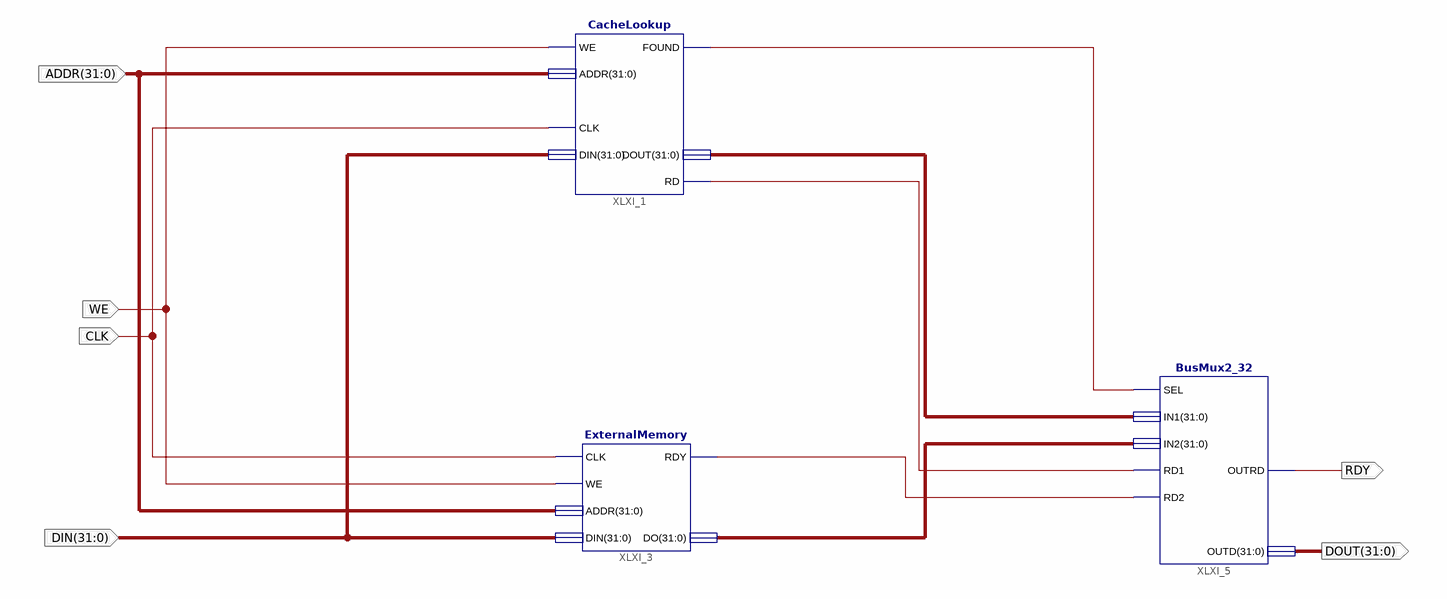
[diagram p0: schematic sheet 1]
// Xilinx ISE schematic CacheDummyTopSch.sch (spartan6) as structural Verilog: 3 symbols, 6 ports
module CacheDummyTopSch (
  input  WE,
  input  CLK,
  input  [31:0] ADDR,
  input  [31:0] DIN,
  output RDY,
  output [31:0] DOUT
);

  wire XLXN_16, XLXN_19, XLXN_22;
  wire [31:0] XLXN_15, XLXN_23;

  CacheLookup XLXI_1 (.WE(WE), .CLK(CLK), .ADDR(ADDR), .DIN(DIN), .FOUND(XLXN_19), .RD(XLXN_22), .DOUT(XLXN_23));
  ExternalMemory XLXI_3 (.CLK(CLK), .WE(WE), .ADDR(ADDR), .DIN(DIN), .RDY(XLXN_16), .DO(XLXN_15));
  BusMux2_32 XLXI_5 (
    .RD1(XLXN_22), .RD2(XLXN_16), .SEL(XLXN_19), .IN1(XLXN_23), .IN2(XLXN_15), .OUTRD(RDY), .OUTD(DOUT));
endmodule
